# Altium schematic sheet Sensor_SINCOS.SchDoc: SINCOS sensor differential to single
size A4; Organization: Institut d'Automatisation Industrielle; SheetNumber: 3; SheetTotal: 3; SVN: OUI; CurrentTime: 6; CurrentDate: 5; DocumentFullPathAndName: 8; DocumentName: 9; ModifiedDate: 13; ProjectName: <projet>
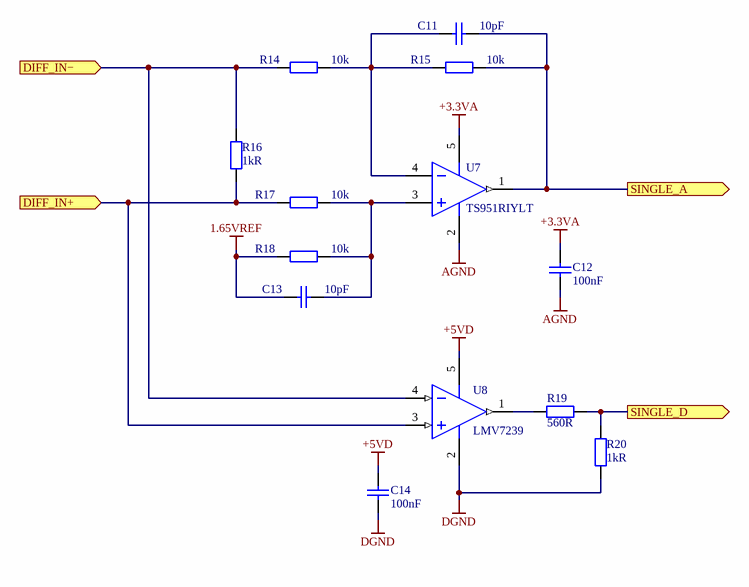
[diagram p0: Sensor_SINCOS.SchDoc]

## Parts
C11  value 10pF  [CAPC1608X08N]  (hidden comment: CAP CER 10pF 0603)
C12  value 100nF  [CAPC1608X08N]  (hidden comment: CAP CER 100nF 0603)
C13  value 10pF  [CAPC1608X08N]  (hidden comment: CAP CER 10pF 0603)
C14  value 100nF  [CAPC1608X08N]  (hidden comment: CAP CER 100nF 0603)
R14  value 10k  [RESC1508X04N]  (hidden comment: RES SMD 10K 0603)
R15  value 10k  [RESC1508X04N]  (hidden comment: RES SMD 10K 0603)
R16  value 1kR  [RESC1508X04N]  (hidden comment: RES SMD 1K 0603)
R17  value 10k  [RESC1508X04N]  (hidden comment: RES SMD 10K 0603)
R18  value 10k  [RESC1508X04N]  (hidden comment: RES SMD 10K 0603)
R19  value 560R  [RESC1508X04N]  (hidden comment: RES SMD 560R 0603)
R20  value 1kR  [RESC1508X04N]  (hidden comment: RES SMD 1K 0603)
U7  value TS951RIYLT  [SOT95P280X145-5N]  (hidden comment: OPAMP 1 CIRCUIT)
U8  value LMV7239  [SOT95P280X145-5N]  (hidden comment: COMP 1 CIRCUIT)

## Ports
DIFF_IN+ (in), DIFF_IN− (in), SINGLE_A (out), SINGLE_D (out)

## Nets
1.65VREF: C13.2 R18.2
+3.3VA: C12.2 U7.5(IN-)
+5VD: C14.2 U8.5(IN-)
AGND: C12.1 U7.2(IN-)
DGND: C14.1 R20.1 U8.2(IN-)
DIFF_IN+: R16.1 R17.1 U8.3(IN+) ; port DIFF_IN+
DIFF_IN−: R14.1 R16.2 U8.4(IN-) ; port DIFF_IN−
SINGLE_A: C11.2 R15.2 U7.1(OUT) ; port SINGLE_A
SINGLE_D: R19.1 R20.2 ; port SINGLE_D
NetC11_1: C11.1 R14.2 R15.1 U7.4(IN-)
NetC13_1: C13.1 R17.2 R18.1 U7.3(IN+)
NetR19_2: R19.2 U8.1(OUT)

## Notes on the sheet
- Title
- Institut d'automatisation industrielle
  rte de Cheseaux 1
  CH-1401 Yverdon-les-Bains
  T +41(0)24 55 77 377    F +41(0)24 55 76 320
  http://iai.heig-vd.ch       iai@heig-vd.ch
- Date:
- Size:
- A4
- Project:
- Sheet
- of
- No.
- Author:
- SVN
- Version
- File:

## Library data of the parts
C11 C13 = CAP CER 10pF 10% 10V 0603: 10pF ±10% 10V Condensateurs céramique X7R 0603 (1608 métrique); Supplier 1: Digi-Key; Supplier Part Number 1: 399-17563-1-ND
C12 C14 = CAP CER 100nF 10% 10V 0603: 100nF ±10% 10V Condensateurs céramique X7R 0603 (1608 métrique); Supplier 1: Digi-Key; Supplier Part Number 1: 399-1095-1-ND
R14 R15 R17 R18 = RES SMD 10K OHM 1% 1/10W 0603: 10 kOhms ±1% 0,1W, 1/10W Pavé résistif 0603 (1608 métrique) AutomobileAEC-Q200 Couche épaisse; Supplier 1: Digi-Key; Supplier Part Number 1: RMCF0603FT10K0CT-ND
R16 R20 = RES SMD 1K OHM 1% 1/10W 0603: 1 kOhms ±1% 0,1W, 1/10W Pavé résistif 0603 (1608 métrique) AutomobileAEC-Q200 Couche épaisse; Supplier 1: Digi-Key; Supplier Part Number 1: RMCF0603FT1K00CT-ND
R19 = RES SMD 560 OHM 0.1% 1/10W 0603: 560 Ohms ±1% 0,1W, 1/10W Pavé résistif 0603 (1608 métrique) AutomobileAEC-Q200 Couche épaisse; Supplier 1: Digi-Key; Supplier Part Number 1: A139816CT-ND
U7 = IC OPAMP GP 1 CIRCUIT SOT23-5: CMOS Amplificateurs 1 Circuits Pôle à pôle SOT-23-5; Supplier 1: Digi-Key; Supplier Part Number 1: 497-15708-1-ND
U8 = IC COMP PUSH-PULL 1 CIRCUIT SOT-23-5: Comparateurs Usage général Pousser-tirer, rail-à-rail SOT-23-5; Supplier 1: Digi-Key; Supplier Part Number 1: LMV7239M5/NOPBCT-ND